# Altium schematic sheet HV_BlockDiagram.SchDoc
size Legal; Author: Taiping Li; CompanyName: Midnight Sun Solar Rayce Car Team; Revision: 0.1; SheetNumber: 1; SheetTotal: 1; DocumentName: MSXII - HV Schematic
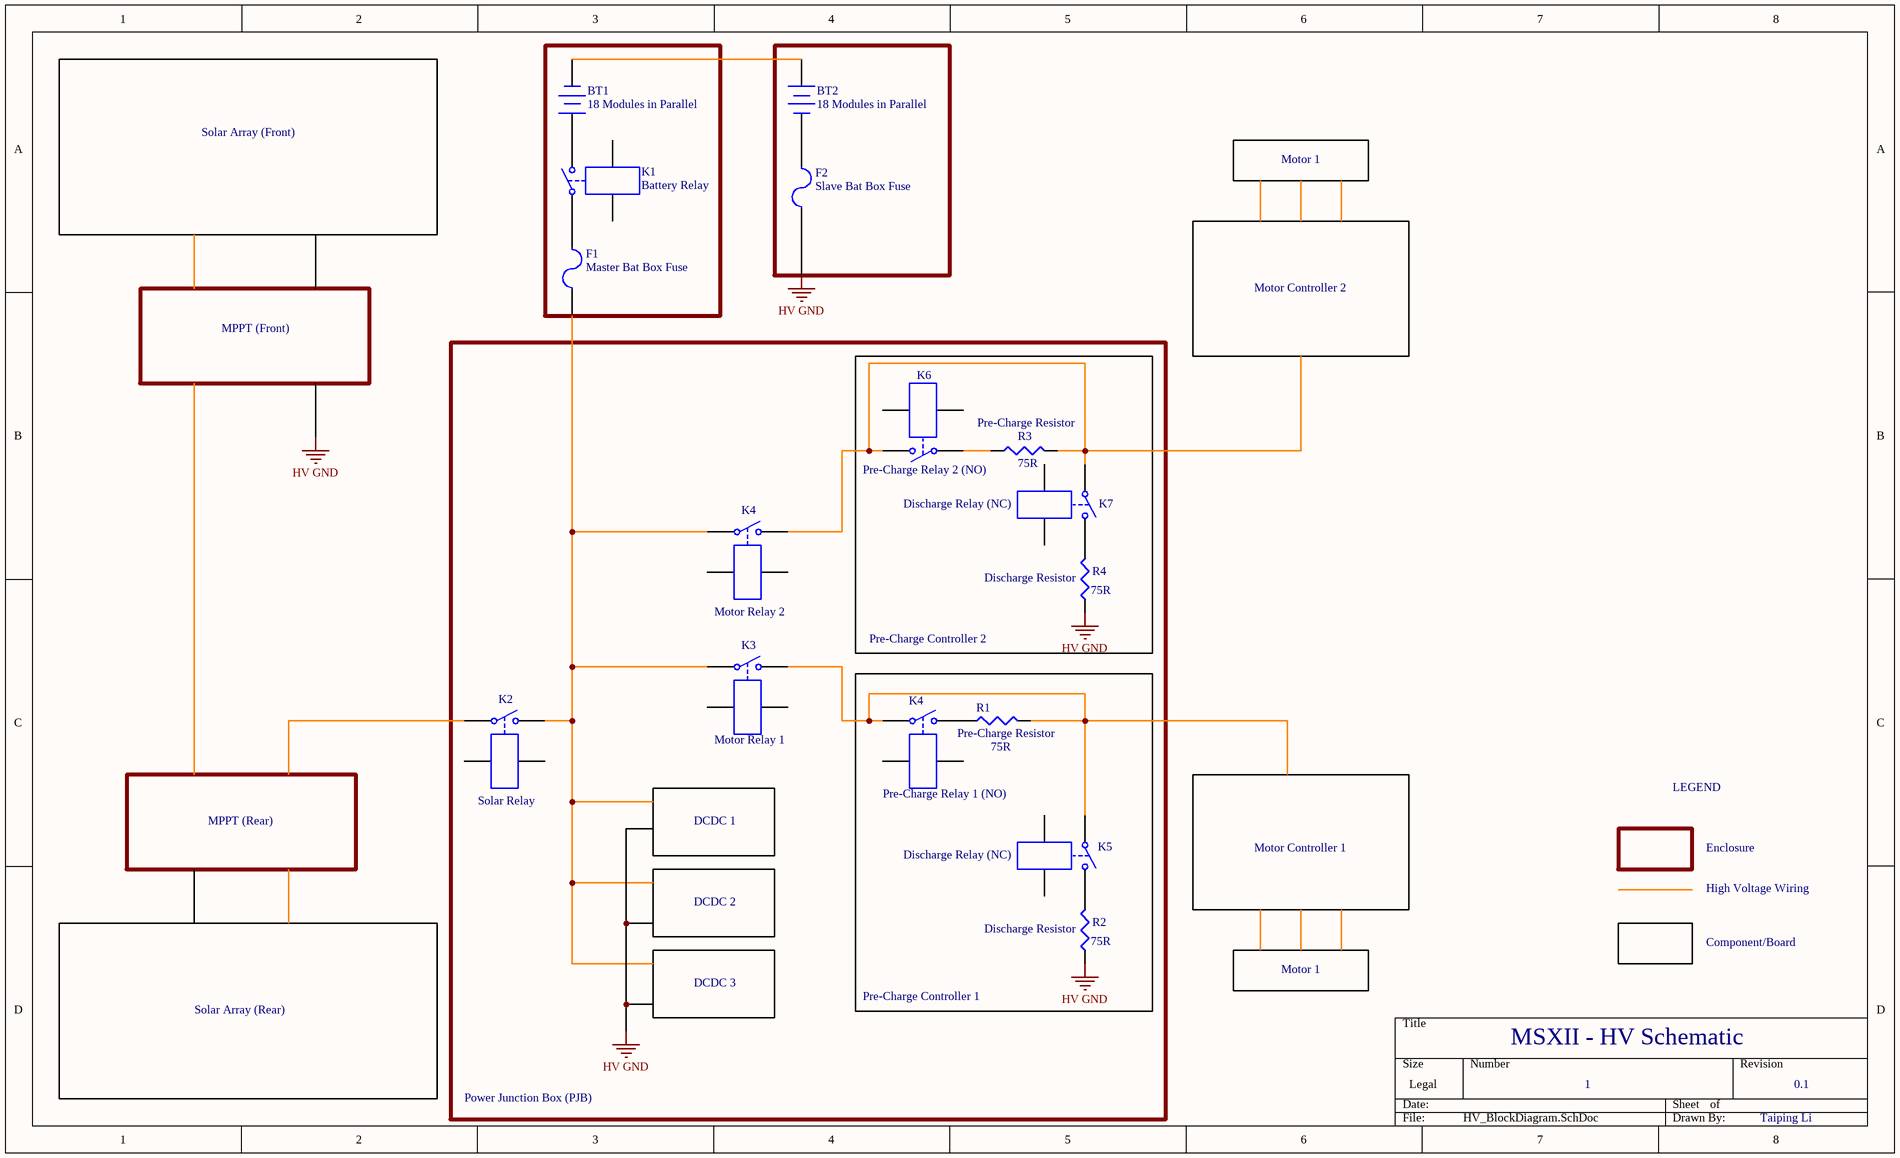
[diagram p0: HV_BlockDiagram.SchDoc]

## Parts
(Parts that share a designator on the sheet are numbered #1, #2 ... from top to bottom, then left to right.)
BT1  18 Modules in Parallel  [BAT-2]
BT2  18 Modules in Parallel  [BAT-2]
F1  Master Bat Box Fuse  [PIN-W2/E2.8]
F2  Slave Bat Box Fuse  [PIN-W2/E2.8]
K1  Battery Relay  [MODULE4]
K2  Solar Relay  [MODULE4]
K3  Motor Relay 1  [MODULE4]
K4#1  Motor Relay 2  [MODULE4]
K4#2  Pre-Charge Relay 1 (NO)  [MODULE4]
K5  Discharge Relay (NC)  [MODULE4]
K6  Pre-Charge Relay 2 (NO)  [MODULE4]
K7  Discharge Relay (NC)  [MODULE4]
R1  Pre-Charge Resistor  value 75R  [J1-0603]
R2  Discharge Resistor  value 75R  [J1-0603]
R3  Pre-Charge Resistor  value 75R  [J1-0603]
R4  Discharge Resistor  value 75R  [J1-0603]

## Blocks framed on the sheet
Pre-Charge Controller 2: K6 K7 R3 R4
Pre-Charge Controller 1: K4#2 K5 R1 R2

## Nets
HV GND: F2.1 R2.1 R4.1
NetBT1_1: BT1.1(+) K1.2
NetBT1_2: BT1.2(-) BT2.1(+)
NetBT2_2: BT2.2(-) F2.2
NetF1_1: F1.1 K2.2 K3.1 K4#1.1
NetF1_2: F1.2 K1.1
NetK3_2: K3.2 K4#2.1 K5.1 R1.2
NetK4#1_2: K4#1.2 K6.2 K7.1 R3.2
NetK4#2_2: K4#2.2 R1.1
NetK5_2: K5.2 R2.2
NetK6_1: K6.1 R3.1
NetK7_2: K7.2 R4.2

Not connected (* = marked no-connect by the designer): K1 3 4; K2 1 3 4; K3 3 4; K4#1 3 4; K4#2 3 4; K5 3 4; K6 3 4; K7 3 4

## Notes on the sheet
- Solar Array (Front)
- Motor 1
- Motor Controller 2
- MPPT (Front)
- MPPT (Rear)
- DCDC 1
- LEGEND
- DCDC 2
- Motor Controller 1
- Enclosure
- High Voltage Wiring
- Component/Board
- Solar Array (Rear)
- DCDC 3
- MSXII - HV Schematic
- Power Junction Box (PJB)

## Library data of the parts
BT1 BT2 = Battery: Multicell Battery; Published: 24-Mar-1999; LatestRevisionDate: 17-Jul-2002; LatestRevisionNote: Re-released for DXP Platform.; PackageReference: BAT-2; Publisher: Altium Limited; PackageDescription: Battery; 2 Leads
F1 F2 = Fuse 2: Fuse; Published: 8-Jun-2000; LatestRevisionDate: 17-Jul-2002; LatestRevisionNote: Re-released for DXP Platform.; PackageReference: PIN-W2/E2.8; Publisher: Altium Limited; PackageDescription: Thru-Hole; 2 Leads
K1-K3 K4#1 K4#2 K5-K7 = Relay-SPST: Single-Pole Single-Throw Relay; Published: 24-Mar-1999; LatestRevisionDate: 17-Jul-2002; LatestRevisionNote: Re-released for DXP Platform.; PackageReference: MODULE4; Publisher: Altium Limited
R1-R4 = Res3: Resistor; Published: 8-Jun-2000; LatestRevisionDate: 29-May-2009; LatestRevisionNote: IPC-7351 Footprint Added.; PackageReference: J1-0603; Publisher: Altium Limited; PackageDescription: Chip Resistor